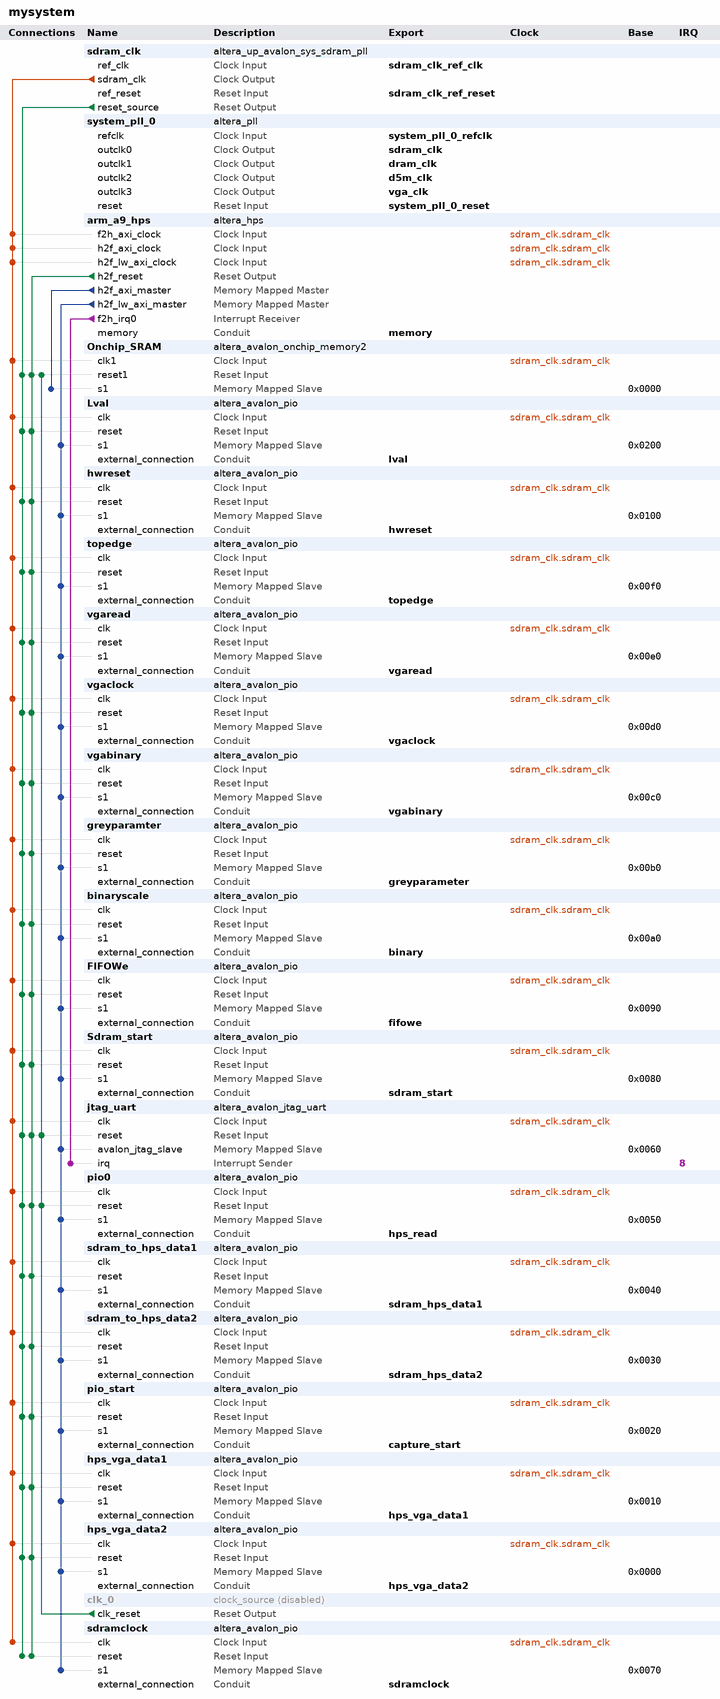
[diagram p0: system contents]
# Platform Designer (Qsys) system mysystem, Cyclone V 5CSEMA5F31C6
# Parameters at their usual value, and those the tool derives, are not listed.
package require -exact qsys 13.1
create_system mysystem
set_project_property DEVICE_FAMILY {Cyclone V}
set_project_property DEVICE 5CSEMA5F31C6

add_instance sdram_clk altera_up_avalon_sys_sdram_pll 13.1
set_instance_parameter_value sdram_clk gui_refclk 50.0
set_instance_parameter_value sdram_clk gui_outclk 50.0
set_instance_parameter_value sdram_clk CV_boards DE1-SoC

add_instance system_pll_0 altera_pll 13.1
set_instance_parameter_value system_pll_0 gui_device_speed_grade 2
set_instance_parameter_value system_pll_0 gui_pll_mode {Integer-N PLL}
set_instance_parameter_value system_pll_0 gui_reference_clock_frequency 50.0
set_instance_parameter_value system_pll_0 gui_operation_mode direct
set_instance_parameter_value system_pll_0 gui_use_locked false
set_instance_parameter_value system_pll_0 gui_number_of_clocks 4
set_instance_parameter_value system_pll_0 gui_output_clock_frequency0 100.0
set_instance_parameter_value system_pll_0 gui_output_clock_frequency1 100.0
set_instance_parameter_value system_pll_0 gui_ps_units1 degrees
set_instance_parameter_value system_pll_0 gui_phase_shift_deg1 -90.0
set_instance_parameter_value system_pll_0 gui_output_clock_frequency2 25.0
set_instance_parameter_value system_pll_0 gui_output_clock_frequency3 25.0

add_instance arm_a9_hps altera_hps 13.1
set_instance_parameter_value arm_a9_hps MEM_VENDOR JEDEC
set_instance_parameter_value arm_a9_hps MEM_CLK_FREQ_MAX 400.0
set_instance_parameter_value arm_a9_hps MEM_ROW_ADDR_WIDTH 12
set_instance_parameter_value arm_a9_hps MEM_COL_ADDR_WIDTH 8
set_instance_parameter_value arm_a9_hps MEM_DQ_WIDTH 8
set_instance_parameter_value arm_a9_hps MEM_BANKADDR_WIDTH 3
set_instance_parameter_value arm_a9_hps MEM_DRV_STR RZQ/6
set_instance_parameter_value arm_a9_hps MEM_RTT_NOM RZQ/6
set_instance_parameter_value arm_a9_hps MEM_RTT_WR {Dynamic ODT off}
set_instance_parameter_value arm_a9_hps MEM_WTCL 6
set_instance_parameter_value arm_a9_hps MEM_TCL 7
set_instance_parameter_value arm_a9_hps TIMING_TIS 175
set_instance_parameter_value arm_a9_hps TIMING_TIH 250
set_instance_parameter_value arm_a9_hps TIMING_TDS 50
set_instance_parameter_value arm_a9_hps TIMING_TDH 125
set_instance_parameter_value arm_a9_hps TIMING_TDQSQ 120
set_instance_parameter_value arm_a9_hps TIMING_TDQSCK 400
set_instance_parameter_value arm_a9_hps TIMING_TQSH 0.38
set_instance_parameter_value arm_a9_hps MEM_TINIT_US 499
set_instance_parameter_value arm_a9_hps MEM_TMRD_CK 3
set_instance_parameter_value arm_a9_hps MEM_TRAS_NS 40.0
set_instance_parameter_value arm_a9_hps MEM_TRCD_NS 15.0
set_instance_parameter_value arm_a9_hps MEM_TRP_NS 15.0
set_instance_parameter_value arm_a9_hps MEM_TREFI_US 7.0
set_instance_parameter_value arm_a9_hps MEM_TRFC_NS 75.0
set_instance_parameter_value arm_a9_hps MEM_TWTR 2
set_instance_parameter_value arm_a9_hps MEM_TFAW_NS 37.5
set_instance_parameter_value arm_a9_hps REF_CLK_FREQ 125.0
set_instance_parameter_value arm_a9_hps DEFAULT_FAST_SIM_MODEL true
set_instance_parameter_value arm_a9_hps TIMING_BOARD_MAX_CK_DELAY 0.6
set_instance_parameter_value arm_a9_hps TIMING_BOARD_MAX_DQS_DELAY 0.6
set_instance_parameter_value arm_a9_hps TIMING_BOARD_SKEW_CKDQS_DIMM_MIN -0.01
set_instance_parameter_value arm_a9_hps TIMING_BOARD_SKEW_CKDQS_DIMM_MAX 0.01
set_instance_parameter_value arm_a9_hps TIMING_BOARD_SKEW_WITHIN_DQS 0.02
set_instance_parameter_value arm_a9_hps TIMING_BOARD_SKEW_BETWEEN_DQS 0.02
set_instance_parameter_value arm_a9_hps TIMING_BOARD_DQ_TO_DQS_SKEW 0.0
set_instance_parameter_value arm_a9_hps TIMING_BOARD_AC_SKEW 0.02
set_instance_parameter_value arm_a9_hps TIMING_BOARD_AC_TO_CK_SKEW 0.0
set_instance_parameter_value arm_a9_hps MEM_CLK_FREQ 300.0
set_instance_parameter_value arm_a9_hps HPS_PROTOCOL DDR3
set_instance_parameter_value arm_a9_hps STM_Enable false
set_instance_parameter_value arm_a9_hps F2S_Width 2
set_instance_parameter_value arm_a9_hps S2F_Width 3
set_instance_parameter_value arm_a9_hps LWH2F_Enable true
set_instance_parameter_value arm_a9_hps F2SCLK_DBGRST_Enable false
set_instance_parameter_value arm_a9_hps F2SCLK_WARMRST_Enable false
set_instance_parameter_value arm_a9_hps F2SCLK_COLDRST_Enable false
set_instance_parameter_value arm_a9_hps F2SINTERRUPT_Enable true
set_instance_parameter_value arm_a9_hps EMAC1_PinMuxing Unused
set_instance_parameter_value arm_a9_hps EMAC1_Mode N/A
set_instance_parameter_value arm_a9_hps QSPI_PinMuxing Unused
set_instance_parameter_value arm_a9_hps QSPI_Mode N/A
set_instance_parameter_value arm_a9_hps SDIO_PinMuxing Unused
set_instance_parameter_value arm_a9_hps SDIO_Mode N/A
set_instance_parameter_value arm_a9_hps USB1_PinMuxing Unused
set_instance_parameter_value arm_a9_hps USB1_Mode N/A
set_instance_parameter_value arm_a9_hps SPIM1_PinMuxing Unused
set_instance_parameter_value arm_a9_hps SPIM1_Mode N/A
set_instance_parameter_value arm_a9_hps UART0_PinMuxing Unused
set_instance_parameter_value arm_a9_hps UART0_Mode N/A
set_instance_parameter_value arm_a9_hps I2C0_PinMuxing Unused
set_instance_parameter_value arm_a9_hps I2C0_Mode N/A
set_instance_parameter_value arm_a9_hps I2C1_PinMuxing Unused
set_instance_parameter_value arm_a9_hps I2C1_Mode N/A
set_instance_parameter_value arm_a9_hps S2FCLK_USER1CLK_FREQ 100
set_instance_parameter_value arm_a9_hps FPGA_PERIPHERAL_OUTPUT_CLOCK_FREQ_EMAC0_MD_CLK 100
set_instance_parameter_value arm_a9_hps FPGA_PERIPHERAL_OUTPUT_CLOCK_FREQ_EMAC0_GTX_CLK 100
set_instance_parameter_value arm_a9_hps FPGA_PERIPHERAL_OUTPUT_CLOCK_FREQ_EMAC1_MD_CLK 100
set_instance_parameter_value arm_a9_hps FPGA_PERIPHERAL_OUTPUT_CLOCK_FREQ_EMAC1_GTX_CLK 100

add_instance Onchip_SRAM altera_avalon_onchip_memory2 13.1
set_instance_parameter_value Onchip_SRAM dataWidth 32
set_instance_parameter_value Onchip_SRAM dualPort false
set_instance_parameter_value Onchip_SRAM initMemContent true
set_instance_parameter_value Onchip_SRAM initializationFileName onchip_mem.hex
set_instance_parameter_value Onchip_SRAM memorySize 16384

add_instance Lval altera_avalon_pio 13.1
set_instance_parameter_value Lval direction Input
set_instance_parameter_value Lval width 1

add_instance hwreset altera_avalon_pio 13.1
set_instance_parameter_value hwreset direction Output
set_instance_parameter_value hwreset width 1

add_instance topedge altera_avalon_pio 13.1
set_instance_parameter_value topedge direction Input
set_instance_parameter_value topedge width 10

add_instance vgaread altera_avalon_pio 13.1
set_instance_parameter_value vgaread direction Input
set_instance_parameter_value vgaread width 1

add_instance vgaclock altera_avalon_pio 13.1
set_instance_parameter_value vgaclock direction Input
set_instance_parameter_value vgaclock width 1

add_instance vgabinary altera_avalon_pio 13.1
set_instance_parameter_value vgabinary direction Output
set_instance_parameter_value vgabinary width 1

add_instance greyparamter altera_avalon_pio 13.1
set_instance_parameter_value greyparamter direction Output
set_instance_parameter_value greyparamter width 8

add_instance binaryscale altera_avalon_pio 13.1
set_instance_parameter_value binaryscale direction Input
set_instance_parameter_value binaryscale width 10

add_instance FIFOWe altera_avalon_pio 13.1
set_instance_parameter_value FIFOWe direction Output
set_instance_parameter_value FIFOWe width 1

add_instance Sdram_start altera_avalon_pio 13.1
set_instance_parameter_value Sdram_start direction Output
set_instance_parameter_value Sdram_start width 1

add_instance jtag_uart altera_avalon_jtag_uart 13.1
set_instance_parameter_value jtag_uart simInteractiveOptions NO_INTERACTIVE_WINDOWS

add_instance pio0 altera_avalon_pio 13.1
set_instance_parameter_value pio0 direction Output
set_instance_parameter_value pio0 width 1

add_instance sdram_to_hps_data1 altera_avalon_pio 13.1
set_instance_parameter_value sdram_to_hps_data1 direction Input
set_instance_parameter_value sdram_to_hps_data1 width 16

add_instance sdram_to_hps_data2 altera_avalon_pio 13.1
set_instance_parameter_value sdram_to_hps_data2 direction Input
set_instance_parameter_value sdram_to_hps_data2 width 16

add_instance pio_start altera_avalon_pio 13.1
set_instance_parameter_value pio_start direction Output
set_instance_parameter_value pio_start width 1

add_instance hps_vga_data1 altera_avalon_pio 13.1
set_instance_parameter_value hps_vga_data1 direction Output
set_instance_parameter_value hps_vga_data1 width 16

add_instance hps_vga_data2 altera_avalon_pio 13.1
set_instance_parameter_value hps_vga_data2 direction Output
set_instance_parameter_value hps_vga_data2 width 16

add_instance clk_0 clock_source 13.1
set_instance_property clk_0 ENABLED false
set_instance_parameter_value clk_0 clockFrequency 50000000

add_instance sdramclock altera_avalon_pio 13.1
set_instance_parameter_value sdramclock direction Output
set_instance_parameter_value sdramclock width 1

# connections
add_connection sdram_clk.sdram_clk arm_a9_hps.f2h_axi_clock clock
add_connection sdram_clk.sdram_clk arm_a9_hps.h2f_axi_clock clock
add_connection sdram_clk.sdram_clk arm_a9_hps.h2f_lw_axi_clock clock
add_connection sdram_clk.sdram_clk binaryscale.clk clock
add_connection sdram_clk.sdram_clk FIFOWe.clk clock
add_connection sdram_clk.sdram_clk greyparamter.clk clock
add_connection sdram_clk.sdram_clk hps_vga_data1.clk clock
add_connection sdram_clk.sdram_clk hps_vga_data2.clk clock
add_connection sdram_clk.sdram_clk hwreset.clk clock
add_connection sdram_clk.sdram_clk jtag_uart.clk clock
add_connection sdram_clk.sdram_clk Lval.clk clock
add_connection sdram_clk.sdram_clk Onchip_SRAM.clk1 clock
add_connection sdram_clk.sdram_clk pio0.clk clock
add_connection sdram_clk.sdram_clk pio_start.clk clock
add_connection sdram_clk.sdram_clk Sdram_start.clk clock
add_connection sdram_clk.sdram_clk sdram_to_hps_data1.clk clock
add_connection sdram_clk.sdram_clk sdram_to_hps_data2.clk clock
add_connection sdram_clk.sdram_clk sdramclock.clk clock
add_connection sdram_clk.sdram_clk topedge.clk clock
add_connection sdram_clk.sdram_clk vgabinary.clk clock
add_connection sdram_clk.sdram_clk vgaclock.clk clock
add_connection sdram_clk.sdram_clk vgaread.clk clock
add_connection arm_a9_hps.h2f_reset binaryscale.reset reset
add_connection arm_a9_hps.h2f_reset FIFOWe.reset reset
add_connection arm_a9_hps.h2f_reset greyparamter.reset reset
add_connection arm_a9_hps.h2f_reset hps_vga_data1.reset reset
add_connection arm_a9_hps.h2f_reset hps_vga_data2.reset reset
add_connection arm_a9_hps.h2f_reset hwreset.reset reset
add_connection arm_a9_hps.h2f_reset jtag_uart.reset reset
add_connection arm_a9_hps.h2f_reset Lval.reset reset
add_connection arm_a9_hps.h2f_reset Onchip_SRAM.reset1 reset
add_connection arm_a9_hps.h2f_reset pio0.reset reset
add_connection arm_a9_hps.h2f_reset pio_start.reset reset
add_connection arm_a9_hps.h2f_reset Sdram_start.reset reset
add_connection arm_a9_hps.h2f_reset sdram_to_hps_data1.reset reset
add_connection arm_a9_hps.h2f_reset sdram_to_hps_data2.reset reset
add_connection arm_a9_hps.h2f_reset sdramclock.reset reset
add_connection arm_a9_hps.h2f_reset topedge.reset reset
add_connection arm_a9_hps.h2f_reset vgabinary.reset reset
add_connection arm_a9_hps.h2f_reset vgaclock.reset reset
add_connection arm_a9_hps.h2f_reset vgaread.reset reset
add_connection clk_0.clk_reset jtag_uart.reset reset
add_connection clk_0.clk_reset Onchip_SRAM.reset1 reset
add_connection clk_0.clk_reset pio0.reset reset
add_connection sdram_clk.reset_source binaryscale.reset reset
add_connection sdram_clk.reset_source FIFOWe.reset reset
add_connection sdram_clk.reset_source greyparamter.reset reset
add_connection sdram_clk.reset_source hps_vga_data1.reset reset
add_connection sdram_clk.reset_source hps_vga_data2.reset reset
add_connection sdram_clk.reset_source hwreset.reset reset
add_connection sdram_clk.reset_source jtag_uart.reset reset
add_connection sdram_clk.reset_source Lval.reset reset
add_connection sdram_clk.reset_source Onchip_SRAM.reset1 reset
add_connection sdram_clk.reset_source pio0.reset reset
add_connection sdram_clk.reset_source pio_start.reset reset
add_connection sdram_clk.reset_source Sdram_start.reset reset
add_connection sdram_clk.reset_source sdram_to_hps_data1.reset reset
add_connection sdram_clk.reset_source sdram_to_hps_data2.reset reset
add_connection sdram_clk.reset_source sdramclock.reset reset
add_connection sdram_clk.reset_source topedge.reset reset
add_connection sdram_clk.reset_source vgabinary.reset reset
add_connection sdram_clk.reset_source vgaclock.reset reset
add_connection sdram_clk.reset_source vgaread.reset reset
add_connection arm_a9_hps.h2f_axi_master Onchip_SRAM.s1 avalon
set_connection_parameter_value arm_a9_hps.h2f_axi_master/Onchip_SRAM.s1 baseAddress 0x0000
add_connection arm_a9_hps.h2f_lw_axi_master binaryscale.s1 avalon
set_connection_parameter_value arm_a9_hps.h2f_lw_axi_master/binaryscale.s1 baseAddress 0x00a0
add_connection arm_a9_hps.h2f_lw_axi_master FIFOWe.s1 avalon
set_connection_parameter_value arm_a9_hps.h2f_lw_axi_master/FIFOWe.s1 baseAddress 0x0090
add_connection arm_a9_hps.h2f_lw_axi_master greyparamter.s1 avalon
set_connection_parameter_value arm_a9_hps.h2f_lw_axi_master/greyparamter.s1 baseAddress 0x00b0
add_connection arm_a9_hps.h2f_lw_axi_master hps_vga_data1.s1 avalon
set_connection_parameter_value arm_a9_hps.h2f_lw_axi_master/hps_vga_data1.s1 baseAddress 0x0010
add_connection arm_a9_hps.h2f_lw_axi_master hps_vga_data2.s1 avalon
set_connection_parameter_value arm_a9_hps.h2f_lw_axi_master/hps_vga_data2.s1 baseAddress 0x0000
add_connection arm_a9_hps.h2f_lw_axi_master hwreset.s1 avalon
set_connection_parameter_value arm_a9_hps.h2f_lw_axi_master/hwreset.s1 baseAddress 0x0100
add_connection arm_a9_hps.h2f_lw_axi_master jtag_uart.avalon_jtag_slave avalon
set_connection_parameter_value arm_a9_hps.h2f_lw_axi_master/jtag_uart.avalon_jtag_slave baseAddress 0x0060
add_connection arm_a9_hps.h2f_lw_axi_master Lval.s1 avalon
set_connection_parameter_value arm_a9_hps.h2f_lw_axi_master/Lval.s1 baseAddress 0x0200
add_connection arm_a9_hps.h2f_lw_axi_master pio0.s1 avalon
set_connection_parameter_value arm_a9_hps.h2f_lw_axi_master/pio0.s1 baseAddress 0x0050
add_connection arm_a9_hps.h2f_lw_axi_master pio_start.s1 avalon
set_connection_parameter_value arm_a9_hps.h2f_lw_axi_master/pio_start.s1 baseAddress 0x0020
add_connection arm_a9_hps.h2f_lw_axi_master Sdram_start.s1 avalon
set_connection_parameter_value arm_a9_hps.h2f_lw_axi_master/Sdram_start.s1 baseAddress 0x0080
add_connection arm_a9_hps.h2f_lw_axi_master sdram_to_hps_data1.s1 avalon
set_connection_parameter_value arm_a9_hps.h2f_lw_axi_master/sdram_to_hps_data1.s1 baseAddress 0x0040
add_connection arm_a9_hps.h2f_lw_axi_master sdram_to_hps_data2.s1 avalon
set_connection_parameter_value arm_a9_hps.h2f_lw_axi_master/sdram_to_hps_data2.s1 baseAddress 0x0030
add_connection arm_a9_hps.h2f_lw_axi_master sdramclock.s1 avalon
set_connection_parameter_value arm_a9_hps.h2f_lw_axi_master/sdramclock.s1 baseAddress 0x0070
add_connection arm_a9_hps.h2f_lw_axi_master topedge.s1 avalon
set_connection_parameter_value arm_a9_hps.h2f_lw_axi_master/topedge.s1 baseAddress 0x00f0
add_connection arm_a9_hps.h2f_lw_axi_master vgabinary.s1 avalon
set_connection_parameter_value arm_a9_hps.h2f_lw_axi_master/vgabinary.s1 baseAddress 0x00c0
add_connection arm_a9_hps.h2f_lw_axi_master vgaclock.s1 avalon
set_connection_parameter_value arm_a9_hps.h2f_lw_axi_master/vgaclock.s1 baseAddress 0x00d0
add_connection arm_a9_hps.h2f_lw_axi_master vgaread.s1 avalon
set_connection_parameter_value arm_a9_hps.h2f_lw_axi_master/vgaread.s1 baseAddress 0x00e0
add_connection arm_a9_hps.f2h_irq0 jtag_uart.irq interrupt
set_connection_parameter_value arm_a9_hps.f2h_irq0/jtag_uart.irq irqNumber 8

# exported interfaces
add_interface memory conduit end
set_interface_property memory EXPORT_OF arm_a9_hps.memory
add_interface hps_read conduit end
set_interface_property hps_read EXPORT_OF pio0.external_connection
add_interface vga_clk clock source
set_interface_property vga_clk EXPORT_OF system_pll_0.outclk3
add_interface d5m_clk clock source
set_interface_property d5m_clk EXPORT_OF system_pll_0.outclk2
add_interface dram_clk clock source
set_interface_property dram_clk EXPORT_OF system_pll_0.outclk1
add_interface sdram_clk clock source
set_interface_property sdram_clk EXPORT_OF system_pll_0.outclk0
add_interface system_pll_0_reset reset sink
set_interface_property system_pll_0_reset EXPORT_OF system_pll_0.reset
add_interface system_pll_0_refclk clock sink
set_interface_property system_pll_0_refclk EXPORT_OF system_pll_0.refclk
add_interface sdram_clk_ref_clk clock sink
set_interface_property sdram_clk_ref_clk EXPORT_OF sdram_clk.ref_clk
add_interface sdram_clk_ref_reset reset sink
set_interface_property sdram_clk_ref_reset EXPORT_OF sdram_clk.ref_reset
add_interface capture_start conduit end
set_interface_property capture_start EXPORT_OF pio_start.external_connection
add_interface sdram_hps_data1 conduit end
set_interface_property sdram_hps_data1 EXPORT_OF sdram_to_hps_data1.external_connection
add_interface sdram_hps_data2 conduit end
set_interface_property sdram_hps_data2 EXPORT_OF sdram_to_hps_data2.external_connection
add_interface hps_vga_data1 conduit end
set_interface_property hps_vga_data1 EXPORT_OF hps_vga_data1.external_connection
add_interface hps_vga_data2 conduit end
set_interface_property hps_vga_data2 EXPORT_OF hps_vga_data2.external_connection
add_interface sdramclock conduit end
set_interface_property sdramclock EXPORT_OF sdramclock.external_connection
add_interface sdram_start conduit end
set_interface_property sdram_start EXPORT_OF Sdram_start.external_connection
add_interface fifowe conduit end
set_interface_property fifowe EXPORT_OF FIFOWe.external_connection
add_interface binary conduit end
set_interface_property binary EXPORT_OF binaryscale.external_connection
add_interface greyparameter conduit end
set_interface_property greyparameter EXPORT_OF greyparamter.external_connection
add_interface vgaclock conduit end
set_interface_property vgaclock EXPORT_OF vgaclock.external_connection
add_interface vgabinary conduit end
set_interface_property vgabinary EXPORT_OF vgabinary.external_connection
add_interface vgaread conduit end
set_interface_property vgaread EXPORT_OF vgaread.external_connection
add_interface topedge conduit end
set_interface_property topedge EXPORT_OF topedge.external_connection
add_interface hwreset conduit end
set_interface_property hwreset EXPORT_OF hwreset.external_connection
add_interface lval conduit end
set_interface_property lval EXPORT_OF Lval.external_connection

set_interconnect_requirement {$system} qsys_mm.clockCrossingAdapter HANDSHAKE
set_interconnect_requirement {$system} qsys_mm.maxAdditionalLatency 1
set_interconnect_requirement {$system} qsys_mm.insertDefaultSlave false

save_system mysystem.qsys
